# Altium schematic sheet 3_power.SchDoc
size A4; SheetNumber: 3; SheetTotal: 8
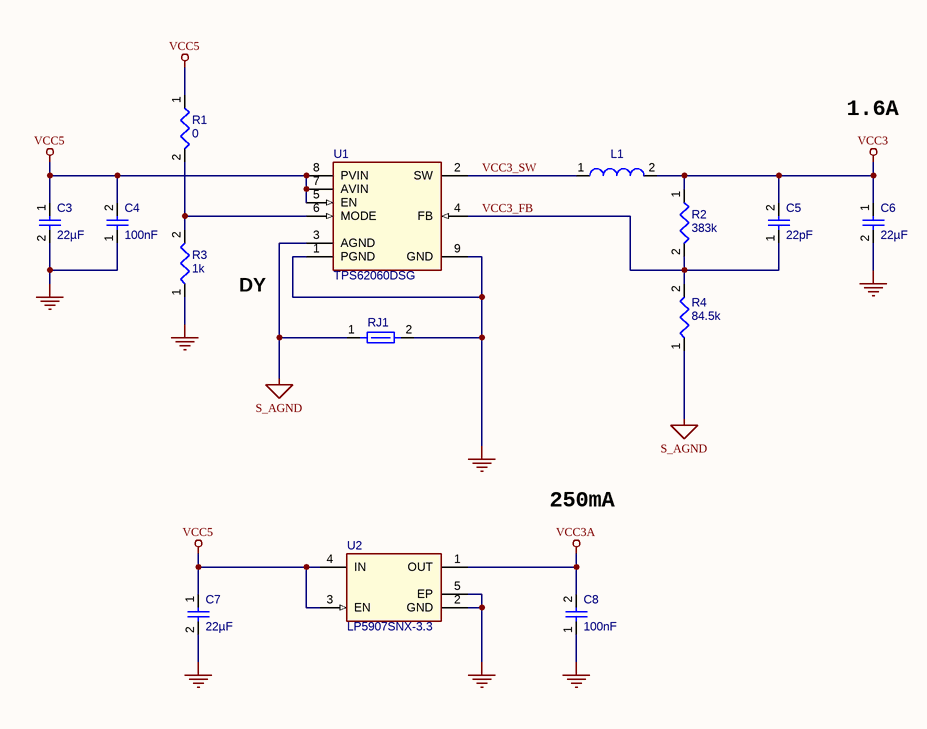
[diagram p0: 3_power.SchDoc]

## Parts
C3  value 22µF  [CAPC0805(2012)145_L]  (hidden comment: Capacitor 22µF +/-40% 16V 0805)
C4  value 100nF  [CAPC0402(1005)60_L]  (hidden comment: Capacitor 100nF +/-20% 10V 0402)
C5  value 22pF  [CAPC0402(1005)60_L]  (hidden comment: Capacitor 22pF +/-10% 50V 0402)
C6  value 22µF  [CAPC0805(2012)145_L]  (hidden comment: Capacitor 22µF +/-40% 16V 0805)
C7  value 22µF  [CAPC0805(2012)145_L]  (hidden comment: Capacitor 22µF +/-40% 16V 0805)
C8  value 100nF  [CAPC0402(1005)60_L]  (hidden comment: Capacitor 100nF +/-20% 10V 0402)
L1  VLS252010HBX-2R2M-1  [TDK-VLS252010_V]  (value not drawn)
R1  value 0  [RESC0402(1005)_L]  (hidden comment: Jumper 0402)
R2  value 383k  [RESC0402(1005)_L]  (hidden comment: Resistor 383K +/-1 % 0402 63 mW)
R3  value 1k  [RESC0402(1005)_L]  (hidden comment: Resistor 1K +/-5 % 0402 63 mW)
R4  value 84.5k  [RESC0402(1005)_L]  (hidden comment: Resistor 84K5 +/-1 % 0402 63 mW)
RJ1  Net Tie 10x8mil  [New footprint 1]  (value not drawn)  (net tie, no BOM)
U1  TPS62060DSG  [DSG0008A_V]
U2  LP5907SNX-3.3  [TI-DQN4-480X480TP_V]

## Nets
GND: C3.2 C4.1 C6.2 C7.2 C8.1 R3.1 RJ1.2 U1.1(PGND) U1.9(GND) U2.2(GND) U2.5(EP)
S_AGND: R4.1 RJ1.1 U1.3(AGND)
VCC3: C5.2 C6.1 L1.2 R2.1
VCC3A: C8.2 U2.1(OUT)
VCC5: C3.1 C4.2 C7.1 R1.1 U1.5(EN) U1.7(AVIN) U1.8(PVIN) U2.3(EN) U2.4(IN)
VCC3_FB: C5.1 R2.2 R4.2 U1.4(FB)
VCC3_SW: L1.1 U1.2(SW)
NetR1_2: R1.2 R3.2 U1.6(MODE)

## Notes on the sheet
- 1.6A
- DY
- 250mA
- Title
- Size:
- Date:
- A4
- Number:
- Time:
- Revision:
- Sheet
- of
- File:

## Library data of the parts
C3 C6 C7 = CMP-001-00081-2: Chip Capacitor, 22µF +/-40%, 16V, 0805, Thickness 1.45 mm; Tolerance: 5%; Voltage Rating: 16V; Case/Package: 0402; Pins: 2; Mounting Technology: SMT; Max Operating Temperature: 85°C; Min Operating Temperature: -55°C
C4 C8 = CMP-001-00061-2: Chip Capacitor, 100nF +/-20%, 10V, 0402, Thickness 0.6 mm; Tolerance: 20%; Case/Package: 0402; Min Operating Temperature: -55°C; Mounting Technology: SMT; Max Operating Temperature: 85°C; Pins: 2; Voltage Rating: 10V
C5 = CMP-001-00073-2: Chip Capacitor, 22pF +/-10%, 50V, 0402, Thickness 0.6 mm; Tolerance: 10%; Mounting Technology: SMT; Pins: 2; Voltage Rating: 50V; Case/Package: 0402; Max Operating Temperature: 85°C; Min Operating Temperature: -55°C
L1 = CMP-006-00020-1: Inductor for Power Circuit, 2.2 uH, +/- 20%, -40 to 105 degC, 2-Pin SMD, RoHS, Tape and Reel; Tolerance: 20%; Mounting Technology: SurfaceMount; Pins: 2
R1 = CMP-009-00148-2: Case/Package: 0402; Max Operating Temperature: 155°C; Min Operating Temperature: -55°C; Pins: 2
R2 = CMP-009-00126-2: Chip Resistor, 383 kOhms, +/-1 %, 63 mW, -55 to 155 degC, 0402; Tolerance: 1%; Power: 63mW; Case/Package: 0402; Max Operating Temperature: 155°C; Min Operating Temperature: -55°C; Pins: 2
R3 = CMP-009-00157-2: Chip Resistor, 1 kOhms, +/-5 %, 63 mW, -55 to 155 degC, 0402; Tolerance: 5%; Power: 63mW; Case/Package: 0402; Max Operating Temperature: 155°C; Min Operating Temperature: -55°C; Pins: 2
R4 = CMP-009-00130-2: Chip Resistor, 84,5 kOhms, +/-1 %, 63 mW, -55 to 155 degC, 0402; Tolerance: 1%; Power: 63mW; Case/Package: 0402; Max Operating Temperature: 155°C; Min Operating Temperature: -55°C; Pins: 2
RJ1 = CMP-009-00116-1: Pins: 2; Max Operating Temperature: 155°C; Min Operating Temperature: -55°C
U1 = CMP-019-00038-1: Step Down Converter, 3 MHz, 1.6 A, -45 to 85 degC, 8-Pin WSON, RoHS, Tape and Reel; Pins: 9
U2 = CMP-019-00040-1: Ultra-Low-Noise, Low-IQ LDO, 3.3 V, 0.25 A, -40 to 125 degC, 4-Pin X2SON, RoHS, Tape and Reel; Output Voltage: 3.3V; Min Operating Temperature: -40°C; Pins: 5; Max Operating Temperature: 125°C